# Altium schematic sheet SCH7_Main_Computer_PCIe.SchDoc: Main Computer - PCIe
size B; Organization: CWRUbotix; Address1: 10900 Euclid Avenue; Address2: Cleveland, OH 44106; Address3: USA; Revision: 1.0; SheetNumber: 7; SheetTotal: 13
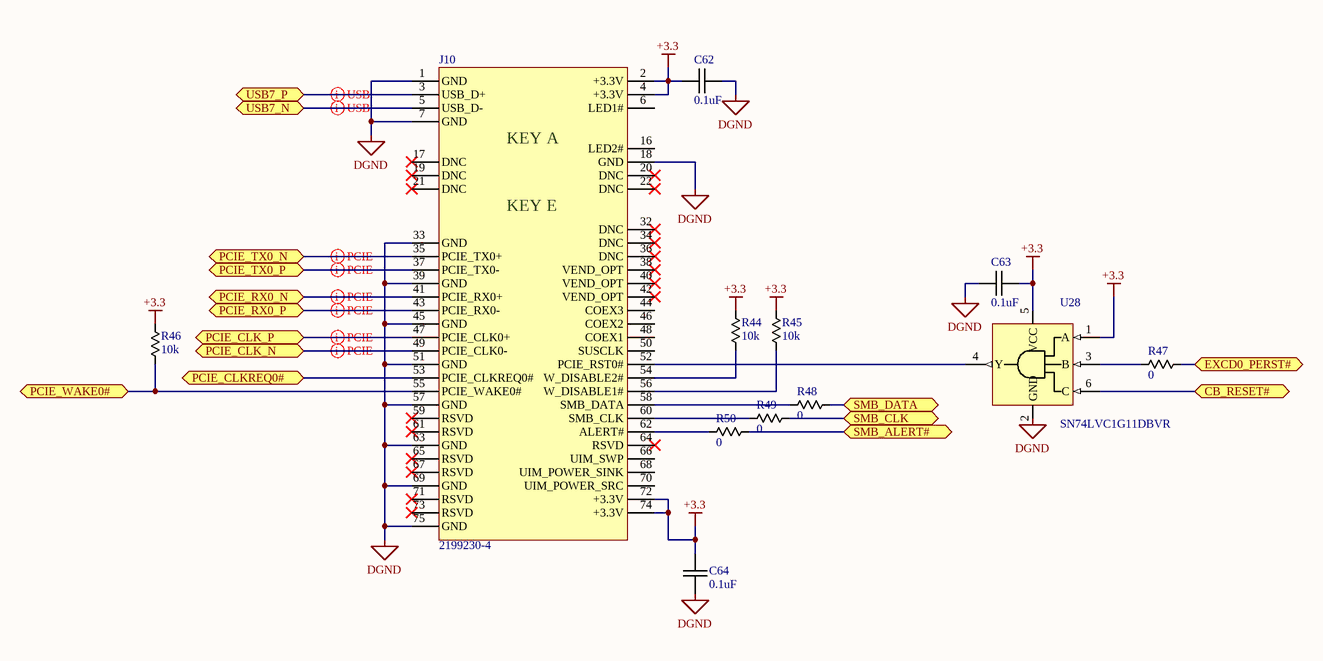
[diagram p0: SCH7_Main_Computer_PCIe.SchDoc]

## Parts
C62  0.1uF  [chip_0603]
C63  0.1uF  [chip_0603]
C64  0.1uF  [chip_0603]
J10  2199230-4  [TE_CONN_2199230-4]
R44  10k  [chip_0603]
R45  10k  [chip_0603]
R46  10k  [chip_0603]
R47  0  [chip_0805]
R48  0  [chip_0805]
R49  0  [chip_0805]
R50  0  [chip_0805]
U28  SN74LVC1G11DBVR  [sot-23-6]

## Ports
CB_RESET# (bidir), EXCD0_PERST# (bidir), PCIE_CLK_N (bidir), PCIE_CLK_P (bidir), PCIE_CLKREQ0# (bidir), PCIE_RX0_N (bidir), PCIE_RX0_P (bidir), PCIE_TX0_N (bidir), PCIE_TX0_P (bidir), PCIE_WAKE0# (bidir), SMB_ALERT# (bidir), SMB_CLK (bidir), SMB_DATA (bidir), USB7_N (bidir), USB7_P (bidir)

## Nets
+3.3: C62.1 C63.2 C64.2 J10.2(+3.3V) J10.4(+3.3V) J10.72(+3.3V) J10.74(+3.3V) R44.1 R45.1 R46.1 U28.1(A) U28.5(VCC)
DGND: C62.2 C63.1 C64.1 J10.1(GND) J10.7(GND) J10.18(GND) J10.33(GND) J10.39(GND) J10.45(GND) J10.51(GND) J10.57(GND) J10.63(GND) J10.69(GND) J10.75(GND) U28.2(GND)
CB_RESET#: U28.6(C) ; port CB_RESET#
EXCD0_PERST#: R47.1 ; port EXCD0_PERST#
PCIE_CLK_N: J10.49(PCIE_CLK0-) ; port PCIE_CLK_N
PCIE_CLK_P: J10.47(PCIE_CLK0+) ; port PCIE_CLK_P
PCIE_CLKREQ0#: J10.53(PCIE_CLKREQ0#) ; port PCIE_CLKREQ0#
PCIE_RX0_N: J10.41(PCIE_RX0+) ; port PCIE_RX0_N
PCIE_RX0_P: J10.43(PCIE_RX0-) ; port PCIE_RX0_P
PCIE_TX0_N: J10.35(PCIE_TX0+) ; port PCIE_TX0_N
PCIE_TX0_P: J10.37(PCIE_TX0-) ; port PCIE_TX0_P
PCIE_WAKE0#: J10.55(PCIE_WAKE0#) R46.2 ; port PCIE_WAKE0#
SMB_ALERT#: R50.1 ; port SMB_ALERT#
SMB_CLK: R49.1 ; port SMB_CLK
SMB_DATA: R48.1 ; port SMB_DATA
USB7_N: J10.5(USB_D-) ; port USB7_N
USB7_P: J10.3(USB_D+) ; port USB7_P
NetJ10_52: J10.52(PCIE_RST0#) U28.4(Y)
NetJ10_54: J10.54(W_DISABLE2#) R44.2
NetJ10_56: J10.56(W_DISABLE1#) R45.2
NetJ10_58: J10.58(SMB_DATA) R48.2
NetJ10_60: J10.60(SMB_CLK) R49.2
NetJ10_62: J10.62(ALERT#) R50.2
NetR47_2: R47.2 U28.3(B)

Not connected (* = marked no-connect by the designer): J10 6(LED1#) 16(LED2#) 17(DNC)* 19(DNC)* 20(DNC)* 21(DNC)* 22(DNC)* 32(DNC)* 34(DNC)* 36(DNC)* 38(VEND_OPT)* 40(VEND_OPT)* 42(VEND_OPT)* 44(COEX3) 46(COEX2) 48(COEX1) 50(SUSCLK) 59(RSVD)* 61(RSVD)* 64(RSVD)* 65(RSVD)* 66(UIM_SWP) 67(RSVD)* 68(UIM_POWER_SINK) 70(UIM_POWER_SRC) 71(RSVD)* 73(RSVD)*

## Layout directives
differential pair: PCIE_CLK_N, PCIE_CLK_P, PCIE_RX0_N, PCIE_RX0_P, PCIE_TX0_N, PCIE_TX0_P, USB7_N, USB7_P

## Notes on the sheet
- Title
- Size:
- B
- Number:
- Revision:
- Date:
- Sheet
- of
- (in symbol CONN-00088) KEY A; KEY E

## Library data of the parts
C62-C64 = CAP-00542: CAP, 0.1uF, ±10%, 16V, X7R, 0603; Manufacturer: Murata; Part Number: CAP-00542; Capacitance: 0.1uF; Tolerance: ±10%; Voltage Rating: 16V; Type: X7R
J10 = CONN-00088: Card-Edge Socket, NGFF (M.2) E-Keyed, PCIe Card Socket; Manufacturer: TE Connectivity; Part Number: CONN-00088; Type: Card Socket; Manufacturer PN: 2199230-4; Cost: 1.33
R44-R46 = RES-00306: RES SMD 10K OHM 1% 1/4W 0603; Manufacturer: Panasonic; Manufacturer PN: ERJ-PA3F1002V; Power Rating: 0.25W; Part Number: RES-00306; Resistance: 10k; Tolerance: 1%; Cost: 0.144
R47-R50 = RES-00720: RES SMD 0 OHM 1/8W 0805 Thick Film; Manufacturer: Stackpole; Manufacturer PN: RMCF0805ZT0R00; Tolerance: Jumper; Part Number: RES-00720; Resistance: 0; Power Rating: 1/8W; Cost: 0.1
U28 = LOGIC-00042: IC, AND Gate, Single 3-Input, 1.65-5.5V, SOT-23-6; Manufacturer: TI; Part Number: LOGIC-00042; Manufacturer PN: SN74LVC1G11DBVR; Cost: $0.37